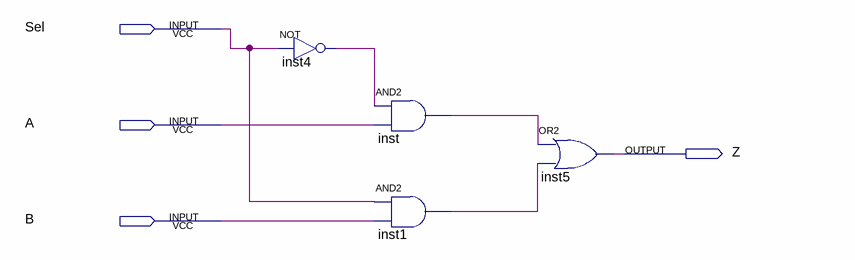
[diagram p0: schematic sheet]
// Quartus schematic Multiplexador.bdf as structural Verilog: 4 symbols, 4 pins
module Multiplexador (
  input  Sel,
  input  A,
  input  B,
  output Z
);

  wire inst1_out, inst4_out, inst_out;

  not inst4 (inst4_out, Sel);
  and inst (inst_out, inst4_out, A);
  and inst1 (inst1_out, Sel, B);
  or inst5 (Z, inst_out, inst1_out);
endmodule
